# Altium schematic sheet Eingang_Ausgang Signal.SchDoc
size A4
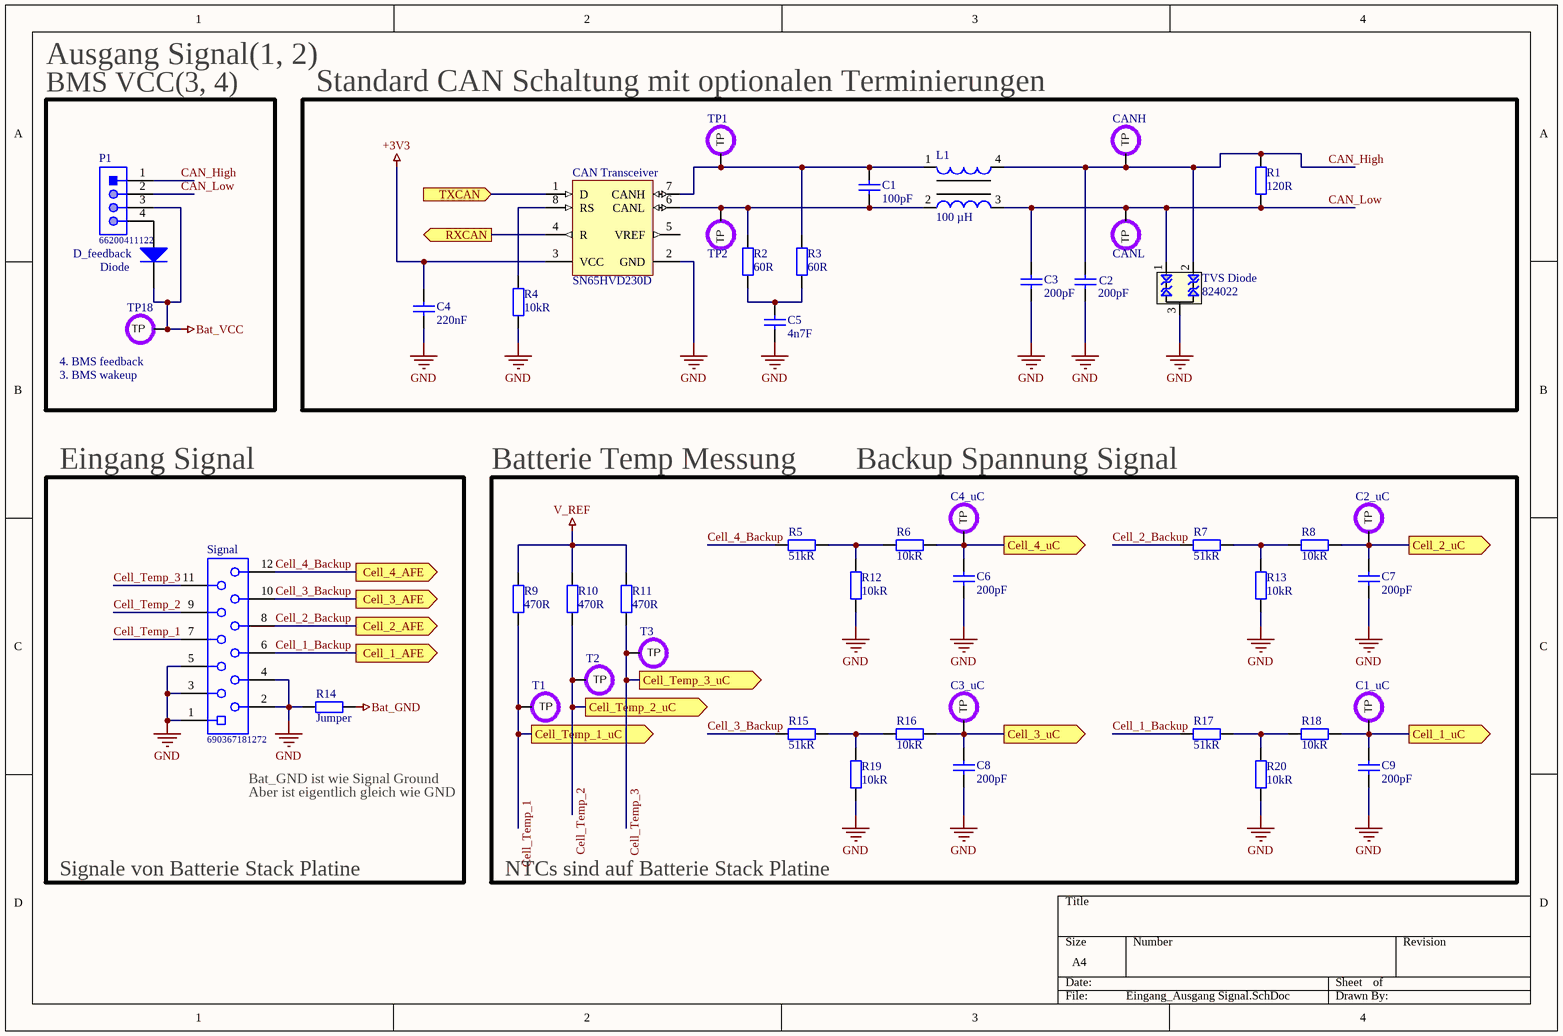
[diagram p0: Eingang_Ausgang Signal.SchDoc]

## Parts
C1  100pF  [1608[0603]]
C1_uC  TP_1  [Test point]  (value not drawn)  (no BOM)
C2  200pF  [1608[0603]]
C2_uC  TP_1  [Test point]  (value not drawn)  (no BOM)
C3  200pF  [1608[0603]]
C3_uC  TP_1  [Test point]  (value not drawn)  (no BOM)
C4  220nF  [1608[0603]]
C4_uC  TP_1  [Test point]  (value not drawn)  (no BOM)
C5  4n7F  [1608[0603]]
C6  200pF  [1608[0603]]
C7  200pF  [1608[0603]]
C8  200pF  [1608[0603]]
C9  200pF  [1608[0603]]
CAN_Transceiver  SN65HVD230D  [D0008A_M]
CANH  TP_1  [Test point]  (value not drawn)  (no BOM)
CANL  TP_1  [Test point]  (value not drawn)  (no BOM)
D_feedback  Diode  [SMB]
L1  100 µH  [WE-SLM]
P1  66200411122  [66200411122]
R1  120R  [J1-0603]
R2  60R  [J1-0603]
R3  60R  [J1-0603]
R4  10kR  [J1-0603]
R5  51kR  [J1-0603]
R6  10kR  [J1-0603]
R7  51kR  [J1-0603]
R8  10kR  [J1-0603]
R9  470R  [J1-0603]
R10  470R  [J1-0603]
R11  470R  [J1-0603]
R12  10kR  [J1-0603]
R13  10kR  [J1-0603]
R14  Jumper  [J1-0603]
R15  51kR  [J1-0603]
R16  10kR  [J1-0603]
R17  51kR  [J1-0603]
R18  10kR  [J1-0603]
R19  10kR  [J1-0603]
R20  10kR  [J1-0603]
Signal  690367181272  [690367181272]
T1  TP_1  [Test point]  (value not drawn)  (no BOM)
T2  TP_1  [Test point]  (value not drawn)  (no BOM)
T3  TP_1  [Test point]  (value not drawn)  (no BOM)
TP1  TP_1  [Test point]  (value not drawn)  (no BOM)
TP2  TP_1  [Test point]  (value not drawn)  (no BOM)
TP18  TP_1  [Test point]  (value not drawn)  (no BOM)
TVS_Diode  824022  [SOT23_3L]

## Blocks framed on the sheet
BMS VCC(3, 4): D_feedback P1 TP18
Standard CAN Schaltung mit optionalen Terminierungen: C1-C5 CAN_Transceiver CANH CANL L1 R1-R4 TP1 TP2 TVS_Diode
Eingang Signal: R14 Signal

## Ports
Cell_1_AFE (out), Cell_1_uC (out), Cell_2_AFE (out), Cell_2_uC (out), Cell_3_AFE (out), Cell_3_uC (out), Cell_4_AFE (out), Cell_4_uC (out), Cell_Temp_1_uC (out), Cell_Temp_2_uC (out), Cell_Temp_3_uC (out), RXCAN (out), TXCAN (in)

## Nets
+3V3: C4.2 CAN_Transceiver.3(VCC)
Bat_GND: R14.1
Bat_VCC: D_feedback.2(K) P1.3 TP18.1(TP)
GND: C2.1 C3.1 C4.1 C5.1 C6.1 C7.1 C8.1 C9.1 CAN_Transceiver.2(GND) R4.1 R12.1 R13.1 R14.2 R19.1 R20.1 Signal.1 Signal.2 Signal.3 Signal.4 Signal.5 TVS_Diode.3(GND)
V_REF: R9.2 R10.2 R11.2
CAN_High: C2.2 CANH.1(TP) L1.4 P1.1 R1.2 TVS_Diode.2(I/O)
CAN_Low: C3.2 CANL.1(TP) L1.3 P1.2 R1.1 TVS_Diode.1(I/O)
Cell_1_Backup: R17.2 Signal.6 ; port Cell_1_AFE
Cell_1_uC: C1_uC.1(TP) C9.2 R18.1 ; port Cell_1_uC
Cell_2_Backup: R7.2 Signal.8 ; port Cell_2_AFE
Cell_2_uC: C2_uC.1(TP) C7.2 R8.1 ; port Cell_2_uC
Cell_3_Backup: R15.2 Signal.10 ; port Cell_3_AFE
Cell_3_uC: C3_uC.1(TP) C8.2 R16.1 ; port Cell_3_uC
Cell_4_Backup: R5.2 Signal.12 ; port Cell_4_AFE
Cell_4_uC: C4_uC.1(TP) C6.2 R6.1 ; port Cell_4_uC
Cell_Temp_1: R9.1 Signal.7 T1.1(TP) ; port Cell_Temp_1_uC
Cell_Temp_2: R10.1 Signal.9 T2.1(TP) ; port Cell_Temp_2_uC
Cell_Temp_3: R11.1 Signal.11 T3.1(TP) ; port Cell_Temp_3_uC
RXCAN: CAN_Transceiver.4(R) ; port RXCAN
TXCAN: CAN_Transceiver.1(D) ; port TXCAN
NetC1_1: C1.1 CAN_Transceiver.6(CANL) L1.2 R2.2 TP2.1(TP)
NetC1_2: C1.2 CAN_Transceiver.7(CANH) L1.1 R3.2 TP1.1(TP)
NetC5_2: C5.2 R2.1 R3.1
NetCAN_Transceiver_8: CAN_Transceiver.8(RS) R4.2
NetD_feedback_1: D_feedback.1(A) P1.4
NetR5_1: R5.1 R6.2 R12.2
NetR7_1: R7.1 R8.2 R13.2
NetR15_1: R15.1 R16.2 R19.2
NetR17_1: R17.1 R18.2 R20.2

Not connected (* = marked no-connect by the designer): CAN_Transceiver 5(VREF)

## Notes on the sheet
- Ausgang Signal(1, 2)
- (near TP18) 4. BMS feedback
- (near TP18) 3. BMS wakeup
- Batterie Temp Messung
- Backup Spannung Signal
- Bat_GND ist wie Signal Ground
- Aber ist eigentlich gleich wie GND
- Signale von Batterie Stack Platine
- NTCs sind auf Batterie Stack Platine

## Library data of the parts
C1 C4 = Cap: Capacitor; Published: 8-Jun-2000; LatestRevisionDate: 17-Jul-2002; LatestRevisionNote: Re-released for DXP Platform.; PackageReference: RAD-0.3; Publisher: Altium Limited; PackageDescription: Radial Cap, Thru-Hole; 2 Leads; 0.3 in Pin Spacing
  C1: Value: 100pF
  C4: Value: 220nF
C1_uC C2_uC C3_uC C4_uC CANH CANL T1-T3 TP1 TP2 TP18 = Test point
C2 C3 C5-C9 = Cap: Capacitor; Value: 220nF; Published: 8-Jun-2000; LatestRevisionDate: 17-Jul-2002; LatestRevisionNote: Re-released for DXP Platform.; PackageReference: RAD-0.3; Publisher: Altium Limited; PackageDescription: Radial Cap, Thru-Hole; 2 Leads; 0.3 in Pin Spacing
CAN_Transceiver = CMP-0315-00046-3: CAN Bus Transceiver, 3.3 V, -40 to 85 degC, 8-Pin SOIC (D), Green (RoHS & no Sb/Br), Tube; Supply Voltage Min: 3 V; Supply Voltage Max: 3.6 V; PartNumber: SN65HVD230D; ComponentLink2URL: http://www.ti.com/general/docs/lit/getliterature.tsp?genericGeneric Part Number=SN65HVD230&fileType=pdf; DatasheetVersion: SLOS346N; Generic Part Number: SN65HVD230; Packing: Tube; Temperature Min: -40 degC; Temperature Max: 85 degC; ComponentLink1Description: Manufacturer URL; Mounting Technology: Surface Mount; RoHS: TRUE; ComponentLink1URL: http://www.ti.com/; ComponentLink2Description: Datasheet; PackageDescription: 8-Pin Plastic Small Outline, Body 4.9 x 3.9 mm, Pitch 1.27 mm
D_feedback = Diode: Default Diode; Published: 8-Jun-2000; LatestRevisionDate: 17-Jul-2002; LatestRevisionNote: Re-released for DXP Platform.; PackageVersion: Sep-1996; PackageReference: SMC; Publisher: Altium Limited; PackageDescription: DO-214-AB/SMC; 2 C-Bend Leads; Body 7.9 x 5.9 mm, inc. leads (LxW); Code_JEDEC: DO-214-AB
L1 = CMP-0222-00021-1: SMD Common Mode Line Filter WE-SLM, L = 100 µH; Inductance: 100 ÂµH; ComponentLink1Description: Manufacturer Link; ComponentLink2URL: http://www.we-online.de/katalog/media/pdf/744242101.pdf; PackageVersion: 2006; PackageReference: WE-SLM; PackageDescription: SMD Inductor, 4-Leads, Body 3.6 x 6.3 mm; ComponentLink1URL: http://www.we-online.com; ComponentLink2Description: Datasheet; DatasheetVersion: ver 3, Feb-2006
P1 = CMP-1502-00442-1: THT Male Header WR-MPC3, Vertical, Single Row, pitch 3 mm, 4 pins; Manufacturer: Wurth Elektronik; Contact Resistance: 10mOhm; Working Voltage: 250VAC; Pin Number: 4; Pitch: 3mm; Manufacturer URL: http://www.we-online.de; Package Reference: 66200411122; Packaging: Tube; Part Number: 66200411122; Publisher: WurthElektronik; Orientation: Vertical; Mounting Technology: THT; Gender: Male; Operating Temperature: -40to105degC; Datasheet URL: https://katalog.we-online.de/em/datasheet/6620xx11122.pdf
R1-R3 R5 R7 R9-R11 R14 R15 R17 = Res2: Resistor; Value: 10kR; Published: 8-Jun-2000; LatestRevisionDate: 17-Jul-2002; LatestRevisionNote: Re-released for DXP Platform.; PackageReference: AXIAL-0.4; Publisher: Altium Limited; PackageDescription: Axial Device, Thru-Hole; 2 Leads; 0.4 in Pin Spacing
R4 R6 R8 R12 R13 R16 R18-R20 = Res2: Resistor; Published: 8-Jun-2000; LatestRevisionDate: 17-Jul-2002; LatestRevisionNote: Re-released for DXP Platform.; PackageReference: AXIAL-0.4; Publisher: Altium Limited; PackageDescription: Axial Device, Thru-Hole; 2 Leads; 0.4 in Pin Spacing; Value: 10kR
Signal = CMP-1502-00845-1: Female THT Straight Connector without Latch and without Polarization WR-MM, 12 pins; Manufacturer: Wurth Elektronik; Working Voltage: 100VAC; Withstanding Voltage: 500VAC; Contact Resistance: 10mOhm; Pin Number: 12; Insulation Resistance: >1000MOhm; Pitch: 2.54mm; Rated Current: 1.5A; Datasheet URL: https://katalog.we-online.de/em/datasheet/690367181272.pdf; Package Reference: 690367181272; Packaging: Tube; Operating Temperature: -40to105degC; Part Number: 690367181272; Gender: Female; Publisher: WurthElektronik; Mounting Technology: THT; Manufacturer URL: http://www.we-online.de
TVS_Diode = CMP-1485-00002-1: TVS Diode WE-TVS-Standard, VRWM=5.0V; Manufacturer: Wuerth Elektronik; Reverse Stand Off Voltage: 5V; ComponentLink1Description: Manufacturer URL; ComponentLink2Description: Datasheet; PackageReference: SOT23_3L; PartNumber: 824022; ComponentLink1URL: http://www.we-online.com; ComponentLink2URL: http://katalog.we-online.de/kataloge/eisos/media/pdf/824022.pdf